# Altium project Twitch_Switch_PCB.PrjPcb (part 1 of 3)
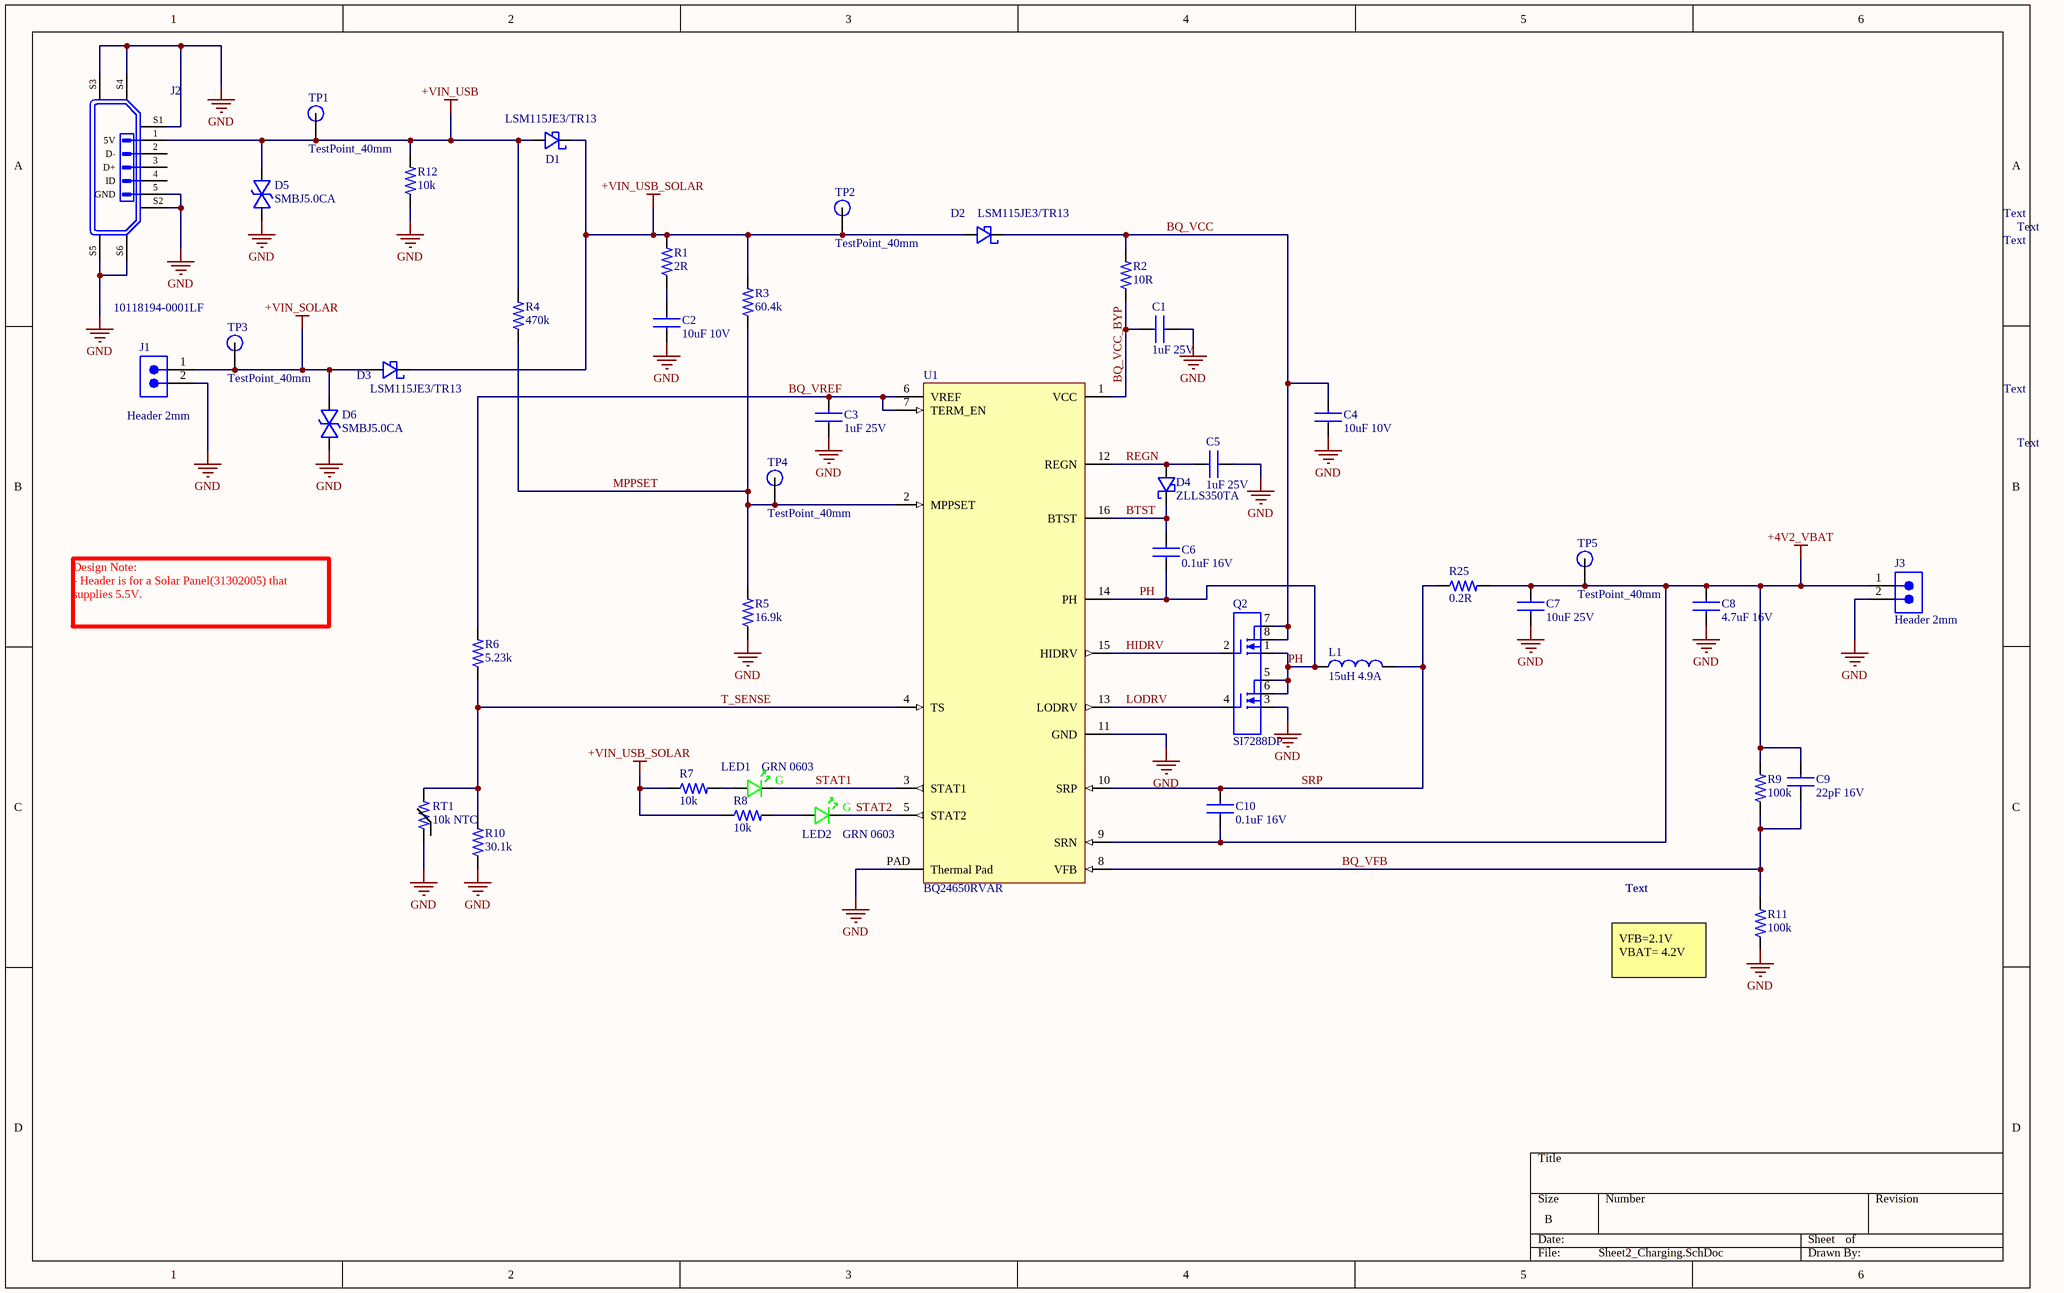
[diagram p0: Sheet2_Charging.SchDoc]
6 sheets, 103 parts. Net scope: global (net labels, ports and power ports of the same name join across sheets).
Board file: Twitch_Switch_PCB.PcbDoc
Sheets:
  Sheet1_Title.SchDoc
  Sheet2_Charging.SchDoc
  Sheet3_Power.SchDoc
  Sheet4_MCU_Sensors.SchDoc
  Sheet5_MCU_PowerDecoupling.SchDoc
  Sheet6_MCU_Antenna_Radio_Interface.SchDoc

## Sheet Sheet1_Title.SchDoc
size A; SheetNumber: 1; SheetTotal: 1

## Sheet Sheet2_Charging.SchDoc
size B; SheetNumber: 2; SheetTotal: 6

### Parts
C1  1uF 25V  [CAP_0805_1_4MM]
C2  10uF 10V  [CAP_0805_1_4MM]
C3  1uF 25V  [CAP_0805_1_4MM]
C4  10uF 10V  [CAP_0805_1_4MM]
C5  1uF 25V  [CAP_0805_1_4MM]
C6  0.1uF 16V  [CAP_0805_1_4MM]
C7  10uF 25V  [CAP_0805_1_4MM]
C8  4.7uF 16V  [CAP_0805_1_4MM]
C9  22pF 16V  [CAP_0805_1_4MM]
C10  0.1uF 16V  [CAP_0805_1_4MM]
D1  LSM115JE3/TR13  [DIODE_4_31X3_62MM]
D2  LSM115JE3/TR13  [DIODE_4_31X3_62MM]
D3  LSM115JE3/TR13  [DIODE_4_31X3_62MM]
D4  ZLLS350TA  [DIODE-SOD_08X16]
D5  SMBJ5.0CA  [DIOM4436X26N]
D6  SMBJ5.0CA  [DIOM4436X26N]
J1  Header 2mm  [2-PIN_MALE_HEADER_2MM]
J2  Manufacturer Part Number: 10118194-0001LF  [micro-USB]  (hidden comment: micro-USB)
J3  Header 2mm  [2-PIN_MALE_HEADER_2MM]
L1  15uH 4.9A  [IND_818X818]
LED1  GRN 0603  [LED_0603_GRN_WL-SMCW]
LED2  GRN 0603  [LED_0603_GRN_WL-SMCW]
Q2  SI7288DP  [FET-SO8_POWERPAK_515X615]
R1  2R  [RES_1206_310X16]
R2  10R  [RES_1206_310X16]
R3  60.4k  [RES_0603_1608X06]
R4  470k  [RES_0603_1608X06]
R5  16.9k  [RES_0603_1608X06]
R6  5.23k  [RES_0603_1608X06]
R7  10k  [RES_0805_2X1_25MM]
R8  10k  [RES_0805_2X1_25MM]
R9  100k  [RES_0603_1608X06]
R10  30.1k  [RES_0603_1608X06]
R11  100k  [RES_0603_1608X06]
R12  10k  [RES_0805_2X1_25MM]
R25  0.2R  [RES_0603_1608X06]
RT1  10k NTC  [NTC-2_THRUHOLE]
TP1  TestPoint_40mm  [TP_40MM]
TP2  TestPoint_40mm  [TP_40MM]
TP3  TestPoint_40mm  [TP_40MM]
TP4  TestPoint_40mm  [TP_40MM]
TP5  TestPoint_40mm  [TP_40MM]
U1  BQ24650RVAR  [16-QFN_3_5x3_5]

### Nets
+4V2_VBAT: C7.1 C8.1 C9.2 C10.2 J3.1 R9.2 R25.2 TP5.1 U1.9(SRN)
+VIN_SOLAR: D3.2(ANODE) D6.1 J1.1 TP3.1
+VIN_USB: D1.2(ANODE) D5.1 J2.1(5V) R4.2 R12.2 TP1.1
+VIN_USB_SOLAR: D1.1(CATHODE) D2.2(ANODE) D3.1(CATHODE) R1.2 R3.2 R7.1 R8.1 TP2.1
GND: C1.2 C2.2 C3.2 C4.2 C5.2 C7.2 C8.2 D5.2 D6.2 J1.2 J2.5(GND) J2.S1(GND) J2.S2(GND) J2.S3(GND) J2.S4(GND) J2.S5(GND) J2.S6(GND) J3.2 Q2.3(S2) R5.1 R10.1 R11.1 R12.1 RT1.1 U1.11(GND) U1.PAD(Thermal_Pad)
BQ_VCC: C4.1 D2.1(CATHODE) Q2.7(D1_1) Q2.8(D1_2) R2.2
BQ_VCC_BYP: C1.1 R2.1 U1.1(VCC)
BQ_VFB: C9.1 R9.1 R11.2 U1.8(VFB)
BQ_VREF: C3.1 R6.2 U1.6(VREF) U1.7(TERM_EN)
BTST: C6.1 D4.1(CATHODE) U1.16(BTST)
HIDRV: Q2.2(G1) U1.15(HIDRV)
LODRV: Q2.4(G2) U1.13(LODRV)
MPPSET: R3.1 R4.1 R5.2 TP4.1 U1.2(MPPSET)
PH: C6.2 L1.1 Q2.1(S1) Q2.5(D2_1) Q2.6(D2_2) U1.14(PH)
REGN: C5.1 D4.2(ANODE) U1.12(REGN)
SRP: C10.1 L1.2 R25.1 U1.10(SRP)
STAT1: LED1.C U1.3(STAT1)
STAT2: LED2.C U1.5(STAT2)
T_SENSE: R6.1 R10.2 RT1.2 U1.4(TS)
NetC2_1: C2.1 R1.1
NetLED1_A: LED1.A R7.2
NetLED2_A: LED2.A R8.2

Not connected (* = marked no-connect by the designer): J2 2(D-) 3(D+) 4(ID)

### Notes on the sheet
- Text
- Design Note:
  - Header is for a Solar Panel(31302005) that supplies 5.5V.
- VFB=2.1V
  VBAT= 4.2V
- (in symbol 150060GS75000) G

### Library data of the parts
C1 C3 C5 = CL21A105KACLNNC: Cap Ceramic 1uF 25V X5R 10% SMD 0805 85C Paper T/R; Manufacturer: Samsung; Supplier 1: Digi-Key; Manufacturer Part Number: CL21A105KACLNNC; RoHS: Yes; Category: Ceramic Capacitors; Stock 1: 356000; Pricing 1: 4000=0.02185, 8000=0.02033 (USD); Mount: Surface Mount; Case/Package: 0805; Case Code (Metric): 2012; Case Code (Imperial): 0805; Min Operating Temperature: -55°C; Max Operating Temperature: 85°C; Capacitance: 1uF; Tolerance: 10%; Dielectric: X5R; Package Quantity: 1; Packaging: Tape and Reel; Voltage Rating: 25V; Series: CL; Construction: Flat; Length: 2mm; Width: 0.049inch; Height: 0.85mm; Depth: 1.25mm; Thickness: 0.037inch; Radiation Hardening: No; Lead Free: Lead Free; RoHS Compliant: Yes; ComponentLink1URL: https://datasheet.ciiva.com/25719/cl21a105kaclnnc-25719413.pdf?src-supplier=Digi-Key; ComponentLink1Description: https://datasheet.ciiva.com/25719/cl21a105kaclnnc-25719413.pdf?src-supplier=Digi-Key; ComponentLink2URL: https://datasheet.ciiva.com/16291/cl21a105kaclnnc-16291978.pdf?src-supplier=Future+Electronics; ComponentLink2Description: https://datasheet.ciiva.com/16291/cl21a105kaclnnc-16291978.pdf?src-supplier=Future+Electronics
C2 C4 = LMK212BJ225MG-T: CAP CER 2.2UF 10V X5R 0805; Manufacturer: Taiyo Yuden; Tolerance: 20%; Supplier 1: Digi-Key; Manufacturer Part Number: LMK212BJ225MG-T; RoHS: Yes; Category: Ceramic Capacitors; Stock 1: 15727; Pricing 1: 1=0.14000, 10=0.10200, 50=0.05780, 100=0.04780, 500=0.03356, 1000=0.02778 (USD); Mount: Surface Mount; Case/Package: 0805; Case Code (Imperial): 0805; Case Code (Metric): 2012; Weight: 0.000194oz; Min Operating Temperature: -55°C; Max Operating Temperature: 85°C; Capacitance: 2.2uF; Packaging: Tape and Reel; Voltage Rating (DC): 10V; Voltage Rating: 10V; Dielectric: X5R; Termination: SMD/SMT; Resistor Type: Ceramic; Voltage: 10V; Series: M; Length: 2mm; Width: 1.25mm; Height: 1.25mm; Thickness: 0.053inch; Depth: 1.25mm; Radiation Hardening: No; Lead Free: Lead Free; Halogen Free: Halogen Free; RoHS Compliant: Yes; ComponentLink1URL: http://www.mouser.com/ds/2/396/mlcc_all_e-541559.pdf?src-supplier=Mouser; ComponentLink1Description: http://www.mouser.com/ds/2/396/mlcc_all_e-541559.pdf?src-supplier=Mouser; ComponentLink2URL: https://www.yuden.co.jp/productdata/catalog/mlcc01_e.pdf?src-supplier=Digi-Key; ComponentLink2Description: https://www.yuden.co.jp/productdata/catalog/mlcc01_e.pdf?src-supplier=Digi-Key; ComponentLink3URL: http://documents.rs-components.com/techlib://itc_doclist_GB.htm?stockno=7582925&src-supplier=RSComponents; ComponentLink3Description: http://documents.rs-components.com/techlib://itc_doclist_GB.htm?stockno=7582925&src-supplier=RSComponents; ComponentLink4URL: http://ds.yuden.co.jp/TYCOMPAS/ut/detail.do?productNo=LMK212BJ225MG-T&fileName=LMK212BJ225MG-T_SS&mode=specSheetDownload&src-supplier=Digi-Key; ComponentLink4Description: http://ds.yuden.co.jp/TYCOMPAS/ut/detail.do?productNo=LMK212BJ225MG-T&fileName=LMK212BJ225MG-T_SS&mode=specSheetDownload&src-supplier=Digi-Key; ComponentLink5URL: http://www.yuden.co.jp/productdata/catalog/en/mlcc_all_e.pdf?src-supplier=Digi-Key; ComponentLink5Description: http://www.yuden.co.jp/productdata/catalog/en/mlcc_all_e.pdf?src-supplier=Digi-Key
C6 C10 = CC0805JRX7R7BB104: CAP CER 0.1UF 16V X7R 0805; Manufacturer: Yageo; Capacitance: 100nF; Tolerance: 5%; Supplier 1: Digi-Key; Manufacturer Part Number: CC0805JRX7R7BB104; RoHS: Yes; Category: Ceramic Capacitors; Stock 1: 2346; Pricing 1: 1=0.12000, 10=0.08400, 50=0.04760, 100=0.03950, 500=0.02768, 1000=0.02291 (USD); Mount: Surface Mount; Case/Package: 0805; Case Code (Imperial): 0805; Case Code (Metric): 2012; Weight: 0.000194oz; Min Operating Temperature: -55°C; Max Operating Temperature: 125°C; Packaging: Tape and Reel; Voltage Rating (DC): 16V; Voltage Rating: 16V; Dielectric: X7R; Termination: SMD/SMT; Resistor Type: Ceramic; Series: CC; Length: 2mm; Width: 0.049inch; Thickness: 0.037inch; Depth: 1.25mm; Radiation Hardening: No; Lead Free: Lead Free; Halogen Free: Halogen Free; RoHS Compliant: Yes; ComponentLink1URL: https://datasheet.ciiva.com/26918/getdatasheetpartid-755584-26918332.pdf?src-supplier=Verical; ComponentLink1Description: https://datasheet.ciiva.com/26918/getdatasheetpartid-755584-26918332.pdf?src-supplier=Verical; ComponentLink2URL: https://datasheet.ciiva.com/17434/upy-gphc-x7r-6-3v-to-50v-8-17434890.pdf?src-supplier=Avnet+Europe; ComponentLink2Description: https://datasheet.ciiva.com/17434/upy-gphc-x7r-6-3v-to-50v-8-17434890.pdf?src-supplier=Avnet+Europe
C7 = GRM21BR61E106KA73K: CAP CER 10UF 25V X5R 0805; Manufacturer: Murata; Tolerance: 10%; Supplier 1: Digi-Key; Manufacturer Part Number: GRM21BR61E106KA73K; RoHS: Yes; Category: Ceramic Capacitors; Stock 1: 101639; Pricing 1: 1=0.23000, 10=0.15700, 50=0.09400, 100=0.07940, 500=0.05434, 1000=0.04807, 2500=0.04598, 5000=0.04180 (USD); Mount: Surface Mount; Case/Package: 0805; Weight: 0.000335oz; Min Operating Temperature: -55°C; Max Operating Temperature: 85°C; Packaging: Tape and Reel; Capacitance: 10uF; Voltage Rating: 25V; Package Quantity: 10000; Dielectric: X5R; Voltage Rating (DC): 25V; Length: 0.079inch; Width: 0.049inch; Thickness: 0.055inch; RoHS Compliant: Yes; ComponentLink1URL: http://www.mouser.com/ds/2/281/c02e-2905.pdf?src-supplier=Mouser; ComponentLink1Description: http://www.mouser.com/ds/2/281/c02e-2905.pdf?src-supplier=Mouser; ComponentLink2URL: http://search.murata.co.jp/Ceramy/image/img/A01X/G101/ENG/GRM21BR61E106KA73-01.pdf?src-supplier=Digi-Key; ComponentLink2Description: http://search.murata.co.jp/Ceramy/image/img/A01X/G101/ENG/GRM21BR61E106KA73-01.pdf?src-supplier=Digi-Key; ComponentLink3URL: https://search.murata.co.jp/Ceramy/image/img/A01X/G101/ENG/GRM21BR61E106KA73-01.pdf?src-supplier=Digi-Key; ComponentLink3Description: https://search.murata.co.jp/Ceramy/image/img/A01X/G101/ENG/GRM21BR61E106KA73-01.pdf?src-supplier=Digi-Key
C8 = CL21A475KOFNNNG: CAP CER 4.7UF 16V X5R 0805; Manufacturer: Samsung; Material: Ceramic; Tolerance: 10%; Supplier 1: Digi-Key; Manufacturer Part Number: CL21A475KOFNNNG; RoHS: Yes; Category: Ceramic Capacitors; Stock 1: 18827; Pricing 1: 1=0.12000, 10=0.08800, 50=0.05000, 100=0.04140, 500=0.02906, 1000=0.02405 (USD); Mount: Surface Mount; Case/Package: 0805; Case Code (Metric): 2012; Case Code (Imperial): 0805; Min Operating Temperature: -55°C; Max Operating Temperature: 85°C; Capacitance: 4.7uF; Package Quantity: 3000; Packaging: Tape and Reel; Voltage Rating: 16V; Dielectric: X5R; Voltage: 16V; Series: CL; Length: 2mm; Width: 0.049inch; Height: 1.25mm; Thickness: 0.053inch; Depth: 1.25mm; Lead Free: Lead Free; RoHS Compliant: Yes; ComponentLink1URL: https://datasheet.ciiva.com/25731/cl21a475kofnnng-25731814.pdf?src-supplier=Digi-Key; ComponentLink1Description: https://datasheet.ciiva.com/25731/cl21a475kofnnng-25731814.pdf?src-supplier=Digi-Key; ComponentLink2URL: https://datasheet.ciiva.com/29199/455276-da-01-en-vs-kondensator-0805-29199361.pdf?src-supplier=Conrad; ComponentLink2Description: https://datasheet.ciiva.com/29199/455276-da-01-en-vs-kondensator-0805-29199361.pdf?src-supplier=Conrad; ComponentLink3URL: https://datasheet.ciiva.com/26310/mlcc-catalogdownload2013-eng-26310158.pdf?src-supplier=Distrelec; ComponentLink3Description: https://datasheet.ciiva.com/26310/mlcc-catalogdownload2013-eng-26310158.pdf?src-supplier=Distrelec; ComponentLink4URL: https://datasheet.ciiva.com/16428/cl05b104kq5nnnc-16428879.pdf?src-supplier=Future+Electronics; ComponentLink4Description: https://datasheet.ciiva.com/16428/cl05b104kq5nnnc-16428879.pdf?src-supplier=Future+Electronics
C9 = VJ0805A220KXJPW1BC: CAP CER 22PF 16V C0G/NP0 0805; Manufacturer: Vishay Vitramon; Dielectric Material: Tantalum; Tolerance: 10%; Dielectric: C0G; Supplier 1: Digi-Key; Manufacturer Part Number: VJ0805A220KXJPW1BC; RoHS: Yes; Category: Ceramic Capacitors; Stock 1: 14990; Pricing 1: 1=0.20000, 10=0.14000, 50=0.07940, 100=0.06580, 500=0.04614, 1000=0.03819, 2500=0.03554, 5000=0.03252 (USD); Mount: Surface Mount; Case/Package: 0805; Case Code (Imperial): 0805; Case Code (Metric): 2012; Min Operating Temperature: -55°C; Max Operating Temperature: 125°C; Capacitance: 22pF; Voltage Rating (DC): 16V; Packaging: Tape and Reel; Package Quantity: 15000; Termination: SMD/SMT; Series: VJ W1BC; Construction: Flat; Length: 2mm; Width: 1.25mm; Height: 1.45mm; Depth: 1.25mm; Lead Free: Lead Free; RoHS Compliant: Yes; ComponentLink1URL: http://www.mouser.com/ds/2/427/vjw1bcbascomseries-223529.pdf?src-supplier=Mouser; ComponentLink1Description: http://www.mouser.com/ds/2/427/vjw1bcbascomseries-223529.pdf?src-supplier=Mouser; ComponentLink2URL: http://www.vishay.com/docs/28548/vjw1bcbascomseries.pdf?src-supplier=Avnet; ComponentLink2Description: http://www.vishay.com/docs/28548/vjw1bcbascomseries.pdf?src-supplier=Avnet; ComponentLink3URL: https://www.vishay.com/docs/28548/vjw1bcbascomseries.pdf?src-supplier=Digi-Key; ComponentLink3Description: https://www.vishay.com/docs/28548/vjw1bcbascomseries.pdf?src-supplier=Digi-Key
D1-D3 = LSM115JE3/TR13: DIODE SCHOTTKY 30V 200MA SOD323; Manufacturer: Microsemi; Forward Voltage: 220mV; Forward Current: 1A; Max Reverse Current: 10mA; Reverse Voltage (DC): 15V; Peak Non-Repetitive Surge Current: 50A; Element Configuration: Single; Max Reverse Leakage Current: 50uA; Power Dissipation: 250mW; Supplier 1: Digi-Key; Manufacturer Part Number: LSM115JE3/TR13; RoHS: Yes; Category: Rectifier Diodes; Stock 1: 39247; Pricing 1: 1=1.08000, 10=0.88700, 100=0.69010, 500=0.58490, 1000=0.47647 (USD); Mount: Surface Mount; Number of Pins: 2; Weight: 0.003668oz; Min Operating Temperature: -55°C; Max Operating Temperature: 100°C; Packaging: Tape and Reel; Package Quantity: 3000; Average Rectified Current: 1A; Max Repetitive Reverse Voltage (Vrrm): 15V; Max Forward Surge Current (Ifsm): 50A; Max Reverse Voltage (DC): 15V; Radiation Hardening: No; Lead Free: Lead Free; ComponentLink1URL: https://datasheet.ciiva.com/917/lsm115j-917432.pdf?src-supplier=Digi-Key; ComponentLink1Description: https://datasheet.ciiva.com/917/lsm115j-917432.pdf?src-supplier=Digi-Key; Supplier 2: Digi-Key; Stock 2: 32; Pricing 2: 1=0.63000, 10=0.54300, 100=0.37560, 500=0.31386, 1000=0.26712 (USD); Max Surge Current: 1A; Voltage: 30V; Series: -; RoHS Compliant: No; ComponentLink2URL: https://datasheet.ciiva.com/4715/cmdsh2-3-39086-4715895.pdf?src-supplier=Mouser; ComponentLink2Description: https://datasheet.ciiva.com/4715/cmdsh2-3-39086-4715895.pdf?src-supplier=Mouser; ComponentLink3URL: https://datasheet.ciiva.com/16396/cmdsh2-3-16396583.pdf?src-supplier=Future+Electronics; ComponentLink3Description: https://datasheet.ciiva.com/16396/cmdsh2-3-16396583.pdf?src-supplier=Future+Electronics
D4 = ZLLS350TA: Diode Schottky 40V 0.65A 2Pin SOD523; Manufacturer: Diodes Zetex; Forward Current: 650mA; Peak Non-Repetitive Surge Current: 6A; Element Configuration: Single; Forward Voltage: 1V; Max Power Dissipation: 357mW; Max Reverse Current: 4uA; Reverse Recovery Time: 1ns; Average Rectified Current: 380mA; Polarity: Standard; Capacitance: 3.5pF; Diode Type: RECTIFIER; Supplier 1: Digi-Key; Manufacturer Part Number: ZLLS350TA; RoHS: Yes; Category: Schottky Diodes; Stock 1: 114407; Pricing 1: 1=0.44000, 10=0.37700, 100=0.26180, 500=0.20442, 1000=0.16616 (USD); Mount: Surface Mount; Number of Pins: 2; Weight: 3.5E-05oz; Contact Plating: Tin,Matte; Min Operating Temperature: -55°C; Max Operating Temperature: 150°C; Max Repetitive Reverse Voltage (Vrrm): 40V; Packaging: Tape and Reel; Package Quantity: 3000; Max Forward Surge Current (Ifsm): 6A; Power Dissipation: 357mW; Termination: SMD/SMT; Voltage Rating (DC): 40V; Power Rating: 357mW; Current Rating: 380mA; Output Current: 380mA; Max Reverse Voltage (DC): 40V; Series: -; Length: 1.3mm; Width: 0.9mm; Height: 0.8mm; Radiation Hardening: No; Lead Free: Lead Free; RoHS Compliant: Yes; ComponentLink1URL: https://datasheet.ciiva.com/4715/zlls350-4715700.pdf?src-supplier=Avnet; ComponentLink1Description: https://datasheet.ciiva.com/4715/zlls350-4715700.pdf?src-supplier=Avnet; ComponentLink2URL: https://datasheet.ciiva.com/4715/zlls350-4715700.pdf?src-supplier=Mouser; ComponentLink2Description: https://datasheet.ciiva.com/4715/zlls350-4715700.pdf?src-supplier=Mouser; ComponentLink3URL: https://datasheet.ciiva.com/914/zlls350-914216.pdf?src-supplier=Digi-Key; ComponentLink3Description: https://datasheet.ciiva.com/914/zlls350-914216.pdf?src-supplier=Digi-Key; ComponentLink4URL: https://datasheet.ciiva.com/914/zlls350-914217.pdf?src-supplier=Digi-Key; ComponentLink4Description: https://datasheet.ciiva.com/914/zlls350-914217.pdf?src-supplier=Digi-Key; ComponentLink5URL: https://datasheet.ciiva.com/914/zlls350-914218.pdf?src-supplier=Digi-Key; ComponentLink5Description: https://datasheet.ciiva.com/914/zlls350-914218.pdf?src-supplier=Digi-Key
D5 D6 = SMBJ5.0CA: BOURNS - SMBJ5.0CA - TVS Diode, Transil SMBJ Series, Bidirectional, 5 V, 9.2 V, DO-214AA (SMB), 2 Pins; Reverse Standoff Voltage: 5V; Clamping Voltage: 9.2V; Peak Pulse Current: 65.2A; Peak Pulse Power: 600W; Test Current: 10mA; Min Breakdown Voltage: 6.4V; Breakdown Voltage: 7.25V; Number of Elements: 1; Leakage Current: 1.6mA; Max Surge Current: 100A; Element Configuration: Single; Operating Supply Voltage: 3.5V; Power Line Protection: No; Diode Type: ZENER; Supplier 1: Digi-Key; Manufacturer: Bourns; Manufacturer Part Number: SMBJ5.0CA; RoHS: Yes; Category: TVS Diodes; Stock 1: 1299; Pricing 1: 1=0.49000, 10=0.36900, 100=0.22960, 500=0.15710, 1000=0.12084 (USD); Mount: Surface Mount; Case/Package: DO-214AA; Number of Pins: 2; Min Operating Temperature: -55°C; Max Operating Temperature: 150°C; Packaging: Tape and Reel; Polarity: Bidirectional; Direction: Bidirectional; Package Quantity: 1; Reverse Breakdown Voltage: 6.4V; Max Reverse Leakage Current: 1.6mA; Number of Channels: 1; Termination: SMD/SMT; Max Power Dissipation: 600W; Max Breakdown Voltage: 7.25V; Number of Bidirectional Channels: 1; Series: SMBJ; Resistor Type: Zener; Radiation Hardening: No; RoHS Compliant: Yes; REACH SVHC: No SVHC; ComponentLink1URL: https://datasheet.ciiva.com/334/smbj-334706.pdf?src-supplier=Digi-Key; ComponentLink1Description: https://datasheet.ciiva.com/334/smbj-334706.pdf?src-supplier=Digi-Key; ComponentLink2URL: https://datasheet.ciiva.com/334/smbj-334707.pdf?src-supplier=Digi-Key; ComponentLink2Description: https://datasheet.ciiva.com/334/smbj-334707.pdf?src-supplier=Digi-Key; ComponentLink3URL: https://datasheet.ciiva.com/334/smbj-334708.pdf?src-supplier=Digi-Key; ComponentLink3Description: https://datasheet.ciiva.com/334/smbj-334708.pdf?src-supplier=Digi-Key; ComponentLink4URL: https://datasheet.ciiva.com/3022/smbj-3022578.pdf?src-supplier=Avnet; ComponentLink4Description: https://datasheet.ciiva.com/3022/smbj-3022578.pdf?src-supplier=Avnet; ComponentLink5URL: https://datasheet.ciiva.com/8031/1677318-8031161.pdf?src-supplier=Element14; ComponentLink5Description: https://datasheet.ciiva.com/8031/1677318-8031161.pdf?src-supplier=Element14; ComponentLink6URL: https://datasheet.ciiva.com/28410/1677318-28410120.pdf?src-supplier=Element14; ComponentLink6Description: https://datasheet.ciiva.com/28410/1677318-28410120.pdf?src-supplier=Element14; ComponentLink7URL: https://datasheet.ciiva.com/30104/smbj-30104446.pdf?src-supplier=Onlinecomponents.com; ComponentLink7Description: https://datasheet.ciiva.com/30104/smbj-30104446.pdf?src-supplier=Onlinecomponents.com
J1 J3 = B2B-PH-K-S(LF)(SN): Connector Header, PH Series, 2 Position, 2.00mm, Through Hole, Press-Fit, Solder, Natural; Manufacturer: JST; Supplier 1: Digi-Key; Manufacturer Part Number: B2B-PH-K-S(LF)(SN); RoHS: Yes; Category: Connectors; Stock 1: 171845; Pricing 1: 1=0.17000, 10=0.16200, 25=0.12080, 50=0.10360, 250=0.08632, 750=0.07771, 1000=0.07252, 12000=0.05526, 24000=0.05008 (USD); Weight: 0.0625lb; Length: 0.2inch; Width: 0.24inch; Height: 0.35inch; ComponentLink1URL: http://www.farnell.com/datasheets/2057211.pdf?src-supplier=Farnell; ComponentLink1Description: http://www.farnell.com/datasheets/2057211.pdf?src-supplier=Farnell; ComponentLink2URL: http://www.farnell.com/datasheets/2057211.pdf?src-supplier=Element14; ComponentLink2Description: http://www.farnell.com/datasheets/2057211.pdf?src-supplier=Element14; ComponentLink3URL: http://www.farnell.com/datasheets/2057211.pdf?src-supplier=Newark; ComponentLink3Description: http://www.farnell.com/datasheets/2057211.pdf?src-supplier=Newark
J2 = micro-USB: 10118194-0001LF micro-USB paste-in-pad; Manufacturer: FCI; Connector Type: USB - micro B; Number of Contacts: 5; Gender: Receptacle; Specifications: USB 2.0; Current Rating: 1.8 A; Mounting Angle: Right; Insulation Resistance: 1000 MOhms; .Creator: Kailey Shara; .SCHchecked: KS; Supplier 1: Digi-Key; RoHS: RoHS Compliant; Category: Connectors, Interconnects; Stock 1: 27978; Pricing 1: 1=0.46, 10=0.433, 25=0.3712, 50=0.3156, 100=0.3032, 250=0.27224, 500=0.25988 (USD); Packaging: Cut Tape (CT); Mounting Type: Surface Mount, Right Angle, Horizontal; Features: Shielded, Solder Retention; Ingress Protection: -; ComponentLink1URL: http://portal.fciconnect.com/Comergent//fci/drawing/10118194.pdf; ComponentLink1Description: http://portal.fciconnect.com/Comergent//fci/drawing/10118194.pdf; Color: Black; Contact Plating: Gold; Operating Temperature Range: - 55 C to + 85 C; Product: Micro USB Type B Connectors; Termination Style: SMD; Brand: FCI; Contact Material: Copper Alloy; Flammability Rating: UL 94 V-0; Standard: USB 2.0; Standard Pack Qty: 1200; Minimum Order Quantity: 1; Reeling: True; Supplier Part Number 1: 609-4618-1-ND; .PCBchecked: KS
L1 = IHLP3232DZER150M11: Inductor High Current Shielded Wirewound 15uH 20% 100KHz 4.9A 65.3mOhm DCR 3232 T/R; Manufacturer: Vishay Dale; Core Material: Ferrite; Saturation Current: 3.7A; Self Resonant Frequency: 10.3MHz; DC Resistance (DCR): 65.3mR; Supplier 1: Digi-Key; Manufacturer Part Number: IHLP3232DZER150M11; RoHS: Yes; Category: Fixed Inductors; Stock 1: 5273; Pricing 1: 1=1.37000, 10=1.26800, 25=1.17040, 50=0.97520, 100=0.91670, 250=0.81916 (USD); Mount: Surface Mount; Case/Package: 3232; Number of Pins: 2; Contact Plating: Tin; Min Operating Temperature: -55°C; Max Operating Temperature: 125°C; Inductance Tolerance: 20%; Packaging: Tape and Reel; Package Quantity: 500; Current Rating: 4.9A; Tolerance: 20%; Shielding: Shielded; Inductance: 15uH; Test Frequency: 100kHz; Max DC Current: 3.7A; Termination: SMD/SMT; RMS Current (Irms): 4.9A; Series: IHLP-3232DZ-11; Length: 8.89mm; Width: 0.322inch; Height: 4mm; Height - Seated (Max): 0.157inch; Depth: 8.26mm; Radiation Hardening: No; REACH SVHC: Unknown; Military Standard: Not; Lead Free: Lead Free; RoHS Compliant: Yes; ComponentLink1URL: https://datasheet.ciiva.com/6692/ihlp-3232dz-11-6692869.pdf?src-supplier=Digi-Key; ComponentLink1Description: https://datasheet.ciiva.com/6692/ihlp-3232dz-11-6692869.pdf?src-supplier=Digi-Key; ComponentLink2URL: https://datasheet.ciiva.com/6692/ihlp-3232dz-11-6692871.pdf?src-supplier=Digi-Key; ComponentLink2Description: https://datasheet.ciiva.com/6692/ihlp-3232dz-11-6692871.pdf?src-supplier=Digi-Key; ComponentLink3URL: https://datasheet.ciiva.com/6692/ihlp-3232dz-11-6692872.pdf?src-supplier=Digi-Key; ComponentLink3Description: https://datasheet.ciiva.com/6692/ihlp-3232dz-11-6692872.pdf?src-supplier=Digi-Key; ComponentLink4URL: https://datasheet.ciiva.com/8494/ihlp3232dz11-8494905.pdf?src-supplier=Avnet; ComponentLink4Description: https://datasheet.ciiva.com/8494/ihlp3232dz11-8494905.pdf?src-supplier=Avnet
LED1 LED2 = 150060GS75000: LED, 0603, GREEN, 430MCD, 520NM; Manufacturer: Wurth Electronics; Dynamic Catalog: 0603 Rectangle with Flat Top Chip LEDs; 3D Model: SMCW_0603.igs / SMCW_0603.stp / SMCW_0603.wrl; Wavelength - Peak: 515nm; Voltage - Forward (Vf) (Typ): 3.2V; Current - Test: 20mA; Viewing Angle: 140°; Lens Type: Clear; Lens Style/Size: Rectangle with Flat Top, 1.1mm x 0.7mm; Other Names: 732-4971-2; Supplier 1: Digi-Key; Manufacturer Part Number: 150060GS75000; Stock 1: 34964; Pricing 1: 1=0.14, 50=0.129, 100=0.11, 500=0.095 (USD); Standard Package: 4,000; Category: Optoelectronics; Family: LED Indication - Discrete; Series: WL-SMCW; Packaging: Tape & Reel (TR); Color: Green; Wavelength - Dominant: 520nm; Millicandela Rating: 430mcd; Package / Case: 0603 (1608 Metric); Size / Dimension: 1.60mm L x 0.80mm W; Height: 0.70mm; Mounting Type: Surface Mount; Online Catalog: 0603 Rectangle with Flat Top Chip LEDs; ComponentLink1URL: https://katalog.we-online.de/led/datasheet/150060GS75000.pdf?src-supplier=Digi-Key; ComponentLink1Description: https://katalog.we-online.de/led/datasheet/150060GS75000.pdf?src-supplier=Digi-Key; ComponentLink2URL: http://www.produktinfo.conrad.com/datenblaetter/750000-774999/759427-da-01-en-CHIPLED_0603_W_KL_GRUEN_150060GS75000.pdf?src-supplier=Conrad; ComponentLink2Description: http://www.produktinfo.conrad.com/datenblaetter/750000-774999/759427-da-01-en-CHIPLED_0603_W_KL_GRUEN_150060GS75000.pdf?src-supplier=Conrad; Supplier Part Number 1: 732-4971-1-ND
Q2 = SI7288DP-T1-GE3: VISHAY - SI7288DP-T1-GE3 - MOSFET, DUAL N-CH, 40V, 20A, POWERPAK SO; Manufacturer: Vishay Siliconix; Rise Time: 14ns; Gate to Source Voltage (Vgs): 20V; Turn-On Delay Time: 12ns; Turn-Off Delay Time: 16ns; Fall Time: 10ns; Nominal Vgs: 1.2V; Rds On Max: 19mR; Input Capacitance: 565pF; Max Power Dissipation: 15.6W; Drain to Source Resistance: 15.6mR; Number of Elements: 2; Power Dissipation: 3.6W; Threshold Voltage: 2.8V; FET Type: 2 N-Channel; Supplier 1: Digi-Key; Manufacturer Part Number: SI7288DP-T1-GE3; RoHS: Yes; Category: MOSFETs; Stock 1: 23843; Pricing 1: 1=1.60000, 10=1.30700, 25=1.28240, 100=1.01640, 500=0.86152, 1000=0.70180 (USD); Mount: Surface Mount; Number of Pins: 8; Contact Plating: Tin,Matte; Min Operating Temperature: -55°C; Max Operating Temperature: 150°C; Continuous Drain Current (ID): 20A; Packaging: Tape and Reel; Package Quantity: 1; Drain to Source Voltage (Vdss): 40V; Drain to Source Breakdown Voltage: 40V; Element Configuration: Dual; Number of Channels: 2; On-State Resistance: 19mR; Radiation Hardening: No; REACH SVHC: Unknown; Lead Free: Lead Free; ComponentLink1URL: https://datasheet.ciiva.com/1253/si7288dp-1253714.pdf?src-supplier=Newark; ComponentLink1Description: https://datasheet.ciiva.com/1253/si7288dp-1253714.pdf?src-supplier=Newark; ComponentLink2URL: https://datasheet.ciiva.com/4442/si7288dp-244449-4442467.pdf?src-supplier=Mouser; ComponentLink2Description: https://datasheet.ciiva.com/4442/si7288dp-244449-4442467.pdf?src-supplier=Mouser; ComponentLink3URL: https://datasheet.ciiva.com/928/si7288dp-928419.pdf?src-supplier=Digi-Key; ComponentLink3Description: https://datasheet.ciiva.com/928/si7288dp-928419.pdf?src-supplier=Digi-Key; ComponentLink4URL: https://datasheet.ciiva.com/928/si7288dp-928420.pdf?src-supplier=Digi-Key; ComponentLink4Description: https://datasheet.ciiva.com/928/si7288dp-928420.pdf?src-supplier=Digi-Key; ComponentLink5URL: https://datasheet.ciiva.com/928/si7288dp-928421.pdf?src-supplier=Digi-Key; ComponentLink5Description: https://datasheet.ciiva.com/928/si7288dp-928421.pdf?src-supplier=Digi-Key; ComponentLink6URL: https://datasheet.ciiva.com/11161/si7288dp-11161495.pdf?src-supplier=Avnet; ComponentLink6Description: https://datasheet.ciiva.com/11161/si7288dp-11161495.pdf?src-supplier=Avnet; ComponentLink7URL: https://datasheet.ciiva.com/26135/si7288dp-26135833.pdf?src-supplier=Avnet+Europe; ComponentLink7Description: https://datasheet.ciiva.com/26135/si7288dp-26135833.pdf?src-supplier=Avnet+Europe; ComponentLink8URL: https://datasheet.ciiva.com/16287/si7288dp-16287085.pdf?src-supplier=Future+Electronics; ComponentLink8Description: https://datasheet.ciiva.com/16287/si7288dp-16287085.pdf?src-supplier=Future+Electronics
R1 = CRM1206-JW-2R2ELF: BOURNS - CRM1206-JW-2R2ELF - SMD Current Sense Resistor, 2.2 ohm, CRM Series, 1206 [3216 Metric], 500 mW, ± 5%, Thick Film; Resistance: 2.2R; Temperature Coefficient: 200ppm/°C; Power Rating: 500mW; Voltage Rating: 200V; Supplier 1: Digi-Key; Manufacturer: Bourns; Manufacturer Part Number: CRM1206-JW-2R2ELF; RoHS: Yes; Category: Chip SMD Resistors; Stock 1: 20424; Pricing 1: 1=0.14000, 10=0.12200, 25=0.08480, 50=0.06580, 100=0.04700, 250=0.03664, 500=0.02914, 1000=0.02068 (USD); Case/Package: 1206; Number of Pins: 2; Case Code (Metric): 3216; Case Code (Imperial): 1206; Min Operating Temperature: -55°C; Max Operating Temperature: 155°C; Tolerance: 5%; Resistor Type: Thick Film; Packaging: Cut Tape; Package Quantity: 5000; Number of Terminations: 2; Max Power Dissipation: 500mW; Voltage Rating (DC): 200V; Series: CRM1206; Construction: Rectangular; Resistance Tolerance: 5%; Length: 3.1mm; Width: 0.063inch; Height: 0.026inch; Depth: 1.6mm; REACH SVHC: No SVHC; Military Standard: Not; RoHS Compliant: Yes; ComponentLink1URL: https://datasheet.ciiva.com/9123/crm0805-1206-2010-9123253.pdf?src-supplier=Avnet; ComponentLink1Description: https://datasheet.ciiva.com/9123/crm0805-1206-2010-9123253.pdf?src-supplier=Avnet; ComponentLink2URL: https://datasheet.ciiva.com/7985/1859481-7985944.pdf?src-supplier=Element14; ComponentLink2Description: https://datasheet.ciiva.com/7985/1859481-7985944.pdf?src-supplier=Element14; ComponentLink3URL: https://datasheet.ciiva.com/6562/crm0805-1206-2010-6562779.pdf?src-supplier=Digi-Key; ComponentLink3Description: https://datasheet.ciiva.com/6562/crm0805-1206-2010-6562779.pdf?src-supplier=Digi-Key; ComponentLink4URL: https://datasheet.ciiva.com/6562/crm0805-1206-2010-6562780.pdf?src-supplier=Digi-Key; ComponentLink4Description: https://datasheet.ciiva.com/6562/crm0805-1206-2010-6562780.pdf?src-supplier=Digi-Key; ComponentLink5URL: https://datasheet.ciiva.com/6562/crm0805-1206-2010-6562782.pdf?src-supplier=Digi-Key; ComponentLink5Description: https://datasheet.ciiva.com/6562/crm0805-1206-2010-6562782.pdf?src-supplier=Digi-Key; ComponentLink6URL: https://datasheet.ciiva.com/16929/crm0805-1206-2010-16929262.pdf?src-supplier=Avnet+Europe; ComponentLink6Description: https://datasheet.ciiva.com/16929/crm0805-1206-2010-16929262.pdf?src-supplier=Avnet+Europe
R2 = ERJ8ENF10R0V: PANASONIC - ERJ8ENF10R0V - SMD Chip Resistor, 1206 [3216 Metric], 10 ohm, ERJ8EN Series, 200 V, Thick Film, 250 mW; Tolerance: 1%; Temperature Coefficient: 100ppm/°C; Power Rating: 250mW; Voltage Rating: 200V; Supplier 1: Digi-Key; Manufacturer: Panasonic; Manufacturer Part Number: ERJ8ENF10R0V; RoHS: Yes; Category: Chip SMD Resistors; Stock 1: 395438; Pricing 1: 1=0.10000, 10=0.08900, 100=0.03410, 1000=0.01500, 2500=0.01296 (USD); Mount: Surface Mount; Case/Package: 1206; Number of Pins: 2; Contact Plating: Tin; Case Code (Metric): 3216; Case Code (Imperial): 1206; Size Code: 1206; Min Operating Temperature: -55°C; Max Operating Temperature: 155°C; Resistance: 10R; Resistor Type: Thick Film; Packaging: Tape and Reel; Package Quantity: 5000; Number of Terminations: 2; Termination: SMD/SMT; Max Power Dissipation: 250mW; Voltage Rating (DC): 200V; Features: Automotive AEC-Q200; Series: ERJ; Resistance Tolerance: 1%; Construction: Rectangular; Length: 3.2mm; Width: 1.6mm; Height: 0.6mm; Depth: 1.6mm; Radiation Hardening: No; REACH SVHC: No SVHC; Military Standard: Not; Lead Free: Lead Free; RoHS Compliant: Yes; ComponentLink1URL: https://datasheet.ciiva.com/7802/426256-7802460.pdf?src-supplier=Element14; ComponentLink1Description: https://datasheet.ciiva.com/7802/426256-7802460.pdf?src-supplier=Element14; ComponentLink2URL: https://datasheet.ciiva.com/16758/70260748-16758703.pdf?src-supplier=Allied+Electronics; ComponentLink2Description: https://datasheet.ciiva.com/16758/70260748-16758703.pdf?src-supplier=Allied+Electronics; ComponentLink3URL: https://datasheet.ciiva.com/24069/aoa0000ce2-24069071.pdf?src-supplier=Mouser; ComponentLink3Description: https://datasheet.ciiva.com/24069/aoa0000ce2-24069071.pdf?src-supplier=Mouser; ComponentLink4URL: https://datasheet.ciiva.com/6082/426256-6082197.pdf?src-supplier=Farnell; ComponentLink4Description: https://datasheet.ciiva.com/6082/426256-6082197.pdf?src-supplier=Farnell; ComponentLink5URL: https://datasheet.ciiva.com/16724/70260748-16724651.pdf?src-supplier=Allied+Electronics; ComponentLink5Description: https://datasheet.ciiva.com/16724/70260748-16724651.pdf?src-supplier=Allied+Electronics; ComponentLink6URL: https://datasheet.ciiva.com/46372/1678782-46372959.pdf?src-supplier=Element14; ComponentLink6Description: https://datasheet.ciiva.com/46372/1678782-46372959.pdf?src-supplier=Element14
R3 = CRCW060360K4FKEA: VISHAY - CRCW060360K4FKEA - SMD Chip Resistor, 0603 [1608 Metric], 60.4 kohm, CRCW e3 Series, 75 V, Thick Film, 100 mW; Resistance: 60.4kR; Tolerance: 1%; Temperature Coefficient: 100ppm/°C; Max Power Dissipation: 100mW; Voltage Rating: 75V; Supplier 1: Digi-Key; Manufacturer: Vishay; Manufacturer Part Number: CRCW060360K4FKEA; RoHS: Yes; Category: Chip SMD Resistors; Stock 1: 18673; Pricing 1: 1=0.10000, 10=0.03400, 100=0.01390, 1000=0.00624, 2500=0.00542 (USD); Case/Package: 0603; Contact Plating: Tin; Weight: 7.1E-05oz; Case Code (Metric): 1608; Case Code (Imperial): 0603; Size Code: 0603; Min Operating Temperature: -55°C; Max Operating Temperature: 155°C; Resistor Type: Thick Film; Packaging: Tape and Reel; Package Quantity: 10; Number of Terminations: 2; Features: Automotive AEC-Q200; Series: CRCW; Power Rating: 100mW; Termination: SMD/SMT; Voltage Rating (DC): 75V; Resistance Tolerance: 1%; Technology: THICK FILM; Construction: Rectangular; Length: 1.55mm; Width: 0.033inch; Height: 0.45mm; Depth: 0.85mm; Radiation Hardening: No; Lead Free: Lead Free; RoHS Compliant: Yes; REACH SVHC: Unknown; Military Standard: Not; ComponentLink1URL: https://datasheet.ciiva.com/11809/0900766b80d98afc-11809685.pdf?src-supplier=RSComponents; ComponentLink1Description: https://datasheet.ciiva.com/11809/0900766b80d98afc-11809685.pdf?src-supplier=RSComponents; ComponentLink2URL: https://datasheet.ciiva.com/16391/dcrcwe3-16391304.pdf?src-supplier=Future+Electronics; ComponentLink2Description: https://datasheet.ciiva.com/16391/dcrcwe3-16391304.pdf?src-supplier=Future+Electronics; ComponentLink3URL: https://datasheet.ciiva.com/16893/dcrcwe3-16893592.pdf?src-supplier=Avnet+Europe; ComponentLink3Description: https://datasheet.ciiva.com/16893/dcrcwe3-16893592.pdf?src-supplier=Avnet+Europe; ComponentLink4URL: https://datasheet.ciiva.com/3257/dcrcwe3-3257786.pdf?src-supplier=Avnet; ComponentLink4Description: https://datasheet.ciiva.com/3257/dcrcwe3-3257786.pdf?src-supplier=Avnet; ComponentLink5URL: https://datasheet.ciiva.com/2494/dcrcwe3-2494471.pdf?src-supplier=Digi-Key; ComponentLink5Description: https://datasheet.ciiva.com/2494/dcrcwe3-2494471.pdf?src-supplier=Digi-Key; ComponentLink6URL: https://datasheet.ciiva.com/16760/70201119-16760503.pdf?src-supplier=Allied+Electronics; ComponentLink6Description: https://datasheet.ciiva.com/16760/70201119-16760503.pdf?src-supplier=Allied+Electronics; ComponentLink7URL: https://datasheet.ciiva.com/2494/dcrcwe3-2494472.pdf?src-supplier=Digi-Key; ComponentLink7Description: https://datasheet.ciiva.com/2494/dcrcwe3-2494472.pdf?src-supplier=Digi-Key; ComponentLink8URL: https://datasheet.ciiva.com/22676/1847332-22676330.pdf?src-supplier=Element14; ComponentLink8Description: https://datasheet.ciiva.com/22676/1847332-22676330.pdf?src-supplier=Element14; ComponentLink9URL: https://datasheet.ciiva.com/7816/1697337-7816053.pdf?src-supplier=Element14; ComponentLink9Description: https://datasheet.ciiva.com/7816/1697337-7816053.pdf?src-supplier=Element14; ComponentLink10URL: https://datasheet.ciiva.com/2494/dcrcwe3-2494473.pdf?src-supplier=Digi-Key; ComponentLink10Description: https://datasheet.ciiva.com/2494/dcrcwe3-2494473.pdf?src-supplier=Digi-Key; ComponentLink11URL: https://datasheet.ciiva.com/5545/dcrcwe3-109170-5545721.pdf?src-supplier=Mouser; ComponentLink11Description: https://datasheet.ciiva.com/5545/dcrcwe3-109170-5545721.pdf?src-supplier=Mouser; ComponentLink12URL: https://datasheet.ciiva.com/3257/dcrcwe3-3257787.pdf?src-supplier=Avnet; ComponentLink12Description: https://datasheet.ciiva.com/3257/dcrcwe3-3257787.pdf?src-supplier=Avnet
R4 = CRCW0603470KFKEA: VISHAY - CRCW0603470KFKEA - SMD Chip Resistor, 0603 [1608 Metric], 470 kohm, CRCW e3 Series, 75 V, Thick Film, 100 mW; Resistance: 470kR; Tolerance: 1%; Power Rating: 100mW; Temperature Coefficient: 100ppm/°C; Voltage Rating: 75V; Supplier 1: Digi-Key; Manufacturer: Vishay; Manufacturer Part Number: CRCW0603470KFKEA; RoHS: Yes; Category: Chip SMD Resistors; Stock 1: 4420; Pricing 1: 1=0.10000, 10=0.03400, 100=0.01390, 1000=0.00624, 2500=0.00542 (USD); Mount: Surface Mount; Case/Package: 0603; Number of Pins: 2; Contact Plating: Tin; Weight: 7.1E-05oz; Case Code (Metric): 1608; Case Code (Imperial): 0603; Size Code: 0603; Min Operating Temperature: -55°C; Max Operating Temperature: 155°C; Resistor Type: Thick Film; Termination: SMD/SMT; Packaging: Tape and Reel; Package Quantity: 10; Number of Terminations: 2; Max Power Dissipation: 100mW; Voltage Rating (DC): 75V; Features: Automotive AEC-Q200; Series: CRCW; Construction: Rectangular; Resistance Tolerance: 1%; Technology: THICK FILM; Length: 1.55mm; Width: 0.033inch; Height: 0.45mm; Depth: 0.85mm; Radiation Hardening: No; Lead Free: Lead Free; RoHS Compliant: Yes; REACH SVHC: Unknown; Military Standard: Not; ComponentLink1URL: https://datasheet.ciiva.com/11809/0900766b80d98afc-11809059.pdf?src-supplier=RSComponents; ComponentLink1Description: https://datasheet.ciiva.com/11809/0900766b80d98afc-11809059.pdf?src-supplier=RSComponents; ComponentLink2URL: https://datasheet.ciiva.com/2466/dcrcwe3-2466326.pdf?src-supplier=Digi-Key; ComponentLink2Description: https://datasheet.ciiva.com/2466/dcrcwe3-2466326.pdf?src-supplier=Digi-Key; ComponentLink3URL: https://datasheet.ciiva.com/2466/dcrcwe3-2466327.pdf?src-supplier=Digi-Key; ComponentLink3Description: https://datasheet.ciiva.com/2466/dcrcwe3-2466327.pdf?src-supplier=Digi-Key; ComponentLink4URL: https://datasheet.ciiva.com/2466/dcrcwe3-2466328.pdf?src-supplier=Digi-Key; ComponentLink4Description: https://datasheet.ciiva.com/2466/dcrcwe3-2466328.pdf?src-supplier=Digi-Key; ComponentLink5URL: https://datasheet.ciiva.com/7673/1720486-7673467.pdf?src-supplier=Element14; ComponentLink5Description: https://datasheet.ciiva.com/7673/1720486-7673467.pdf?src-supplier=Element14; ComponentLink6URL: https://datasheet.ciiva.com/16430/dcrcwe3-16430126.pdf?src-supplier=Future+Electronics; ComponentLink6Description: https://datasheet.ciiva.com/16430/dcrcwe3-16430126.pdf?src-supplier=Future+Electronics; ComponentLink7URL: https://datasheet.ciiva.com/5551/dcrcwe3-109170-5551097.pdf?src-supplier=Mouser; ComponentLink7Description: https://datasheet.ciiva.com/5551/dcrcwe3-109170-5551097.pdf?src-supplier=Mouser; ComponentLink8URL: https://datasheet.ciiva.com/16760/70201119-16760810.pdf?src-supplier=Allied+Electronics; ComponentLink8Description: https://datasheet.ciiva.com/16760/70201119-16760810.pdf?src-supplier=Allied+Electronics; ComponentLink9URL: https://datasheet.ciiva.com/7673/1697337-7673309.pdf?src-supplier=Element14; ComponentLink9Description: https://datasheet.ciiva.com/7673/1697337-7673309.pdf?src-supplier=Element14; ComponentLink10URL: https://datasheet.ciiva.com/26317/fld-crcw-e3-data-en-26317181.pdf?src-supplier=Distrelec; ComponentLink10Description: https://datasheet.ciiva.com/26317/fld-crcw-e3-data-en-26317181.pdf?src-supplier=Distrelec
R5 = CRCW060316K9FKEAHP: RES SMD 16.9K OHM 1% 1/4W 0603; Manufacturer: Vishay Dale; Resistance: 16.9kR; Max Power Dissipation: 250mW; Temperature Coefficient: 100ppm/°C; Supplier 1: Digi-Key; Manufacturer Part Number: CRCW060316K9FKEAHP; RoHS: Yes; Category: Chip SMD Resistors; Stock 1: 4990; Pricing 1: 1=0.17000, 10=0.14200, 100=0.05530, 1000=0.02317, 2500=0.02124 (USD); Case/Package: 0603; Package Quantity: 5000; Tolerance: 1%; Packaging: Tape and Reel; Resistor Type: Thick Film; Number of Terminations: 2; Features: Automotive AEC-Q200; Series: CRCW-HP; Length: 0.063inch; Width: 0.033inch; Height: 0.022inch; Lead Free: Lead Free; RoHS Compliant: Yes; ComponentLink1URL: https://datasheet.ciiva.com/2576/crcwhpe3-2576879.pdf?src-supplier=Digi-Key; ComponentLink1Description: https://datasheet.ciiva.com/2576/crcwhpe3-2576879.pdf?src-supplier=Digi-Key
R6 = RMCF0603FT5K23: RES SMD 5.23K OHM 1% 1/10W 0603; Manufacturer: Stackpole Electronics; Resistance: 5.23kR; Max Power Dissipation: 100mW; Temperature Coefficient: 100ppm/°C; Supplier 1: Digi-Key; Manufacturer Part Number: RMCF0603FT5K23; RoHS: Yes; Category: Chip SMD Resistors; Stock 1: 29980; Pricing 1: 1=0.10000, 10=0.01600, 100=0.00650, 1000=0.00292, 2500=0.00253 (USD); Mount: Surface Mount; Case/Package: 0603; Case Code (Metric): 1608; Case Code (Imperial): 0603; Contact Plating: Tin,Matte; Min Operating Temperature: -55°C; Max Operating Temperature: 155°C; Tolerance: 1%; Features: Automotive AEC-Q200; Packaging: Tape and Reel; Resistor Type: Thick Film; Number of Terminations: 2; Series: RMCF; Length: 0.061inch; Width: 0.031inch; Height: 0.022inch; Radiation Hardening: No; Lead Free: Lead Free; RoHS Compliant: Yes; ComponentLink1URL: https://www.seielect.com/Catalog/SEI-RMCF_RMCP.pdf?src-supplier=Digi-Key; ComponentLink1Description: https://www.seielect.com/Catalog/SEI-RMCF_RMCP.pdf?src-supplier=Digi-Key; ComponentLink2URL: https://www.seielect.com/catalog/SEI-Packaging.pdf?src-supplier=Digi-Key; ComponentLink2Description: https://www.seielect.com/catalog/SEI-Packaging.pdf?src-supplier=Digi-Key; ComponentLink3URL: https://www.seielect.com/catalog/SEI-RMCF_RMCP.pdf?src-supplier=Avnet; ComponentLink3Description: https://www.seielect.com/catalog/SEI-RMCF_RMCP.pdf?src-supplier=Avnet
R7 R8 R12 = RMCF0805FT10K0: RES 10K OHM 1% 1/8W 0805; Manufacturer: Stackpole Electronics; Resistance: 10kR; Power Rating: 125mW; Temperature Coefficient: 100ppm/°C; Supplier 1: Digi-Key; Manufacturer Part Number: RMCF0805FT10K0; RoHS: Yes; Category: Chip SMD Resistors; Stock 1: 2466676; Pricing 1: 1=0.10000, 10=0.02600, 100=0.01040, 1000=0.00466, 2500=0.00405 (USD); Mount: Surface Mount; Case/Package: 0805; Case Code (Metric): 2012; Case Code (Imperial): 0805; Contact Plating: Tin,Matte; Size Code: 0805; Min Operating Temperature: -55°C; Max Operating Temperature: 155°C; Tolerance: 1%; Packaging: Tape and Reel; Resistor Type: Thick Film; Number of Terminations: 2; Max Power Dissipation: 125mW; Features: Automotive AEC-Q200; Series: RMCF; Construction: Rectangular; Length: 2mm; Width: 0.049inch; Height: 0.026inch; Depth: 1.25mm; Radiation Hardening: No; Lead Free: Lead Free; Military Standard: Not; RoHS Compliant: Yes; ComponentLink1URL: https://datasheet.ciiva.com/15193/getdatasheetpartid-362046-15193525.pdf?src-supplier=Verical; ComponentLink1Description: https://datasheet.ciiva.com/15193/getdatasheetpartid-362046-15193525.pdf?src-supplier=Verical
R9 R11 = RC0603FR-07100KL: RES SMD 100K OHM 1% 1/10W 0603; Manufacturer: Yageo; Resistance: 100 kOhms; Power Rating: 100 mW; Voltage Rating: 50 V; Temperature Coefficient: 100 PPM / C; Supplier 1: Digi-Key; Supplier Part Number 1: 311-100KHRCT-ND; Manufacturer Part Number: RC0603FR-07100KL; Stock 1: 13478446; Pricing 1: 1=0.1, 10=0.022, 100=0.009, 1000=0.0041, 2500=0.0035 (USD); Termination Style: SMD/SMT; Product: Thick Film Resistors General Purpose; Tolerance: 1 %; Case Code - in: 0603; Case Code - mm: 1608; Series: RC; Operating Temperature Range: - 55 C to + 155 C; Packaging: Reel; ComponentLink1URL: http://www.farnell.com/datasheets/2167052.pdf?src-supplier=Element14; ComponentLink1Description: http://www.farnell.com/datasheets/2167052.pdf?src-supplier=Element14; ComponentLink2URL: http://www.farnell.com/datasheets/1868787.pdf?src-supplier=Element14; ComponentLink2Description: http://www.farnell.com/datasheets/1868787.pdf?src-supplier=Element14; ComponentLink3URL: http://documents.rs-components.com/techlib://itc_doclist_GB.htm?stockno=5048940&src-supplier=RSComponents; ComponentLink3Description: http://documents.rs-components.com/techlib://itc_doclist_GB.htm?stockno=5048940&src-supplier=RSComponents; ComponentLink4URL: http://www.farnell.com/datasheets/443971.pdf?src-supplier=Element14; ComponentLink4Description: http://www.farnell.com/datasheets/443971.pdf?src-supplier=Element14
R10 = RMCF0603FT30K1: RES SMD 30.1K OHM 1% 1/10W 0603; Manufacturer: Stackpole Electronics; Resistance: 30.1kR; Power Rating: 100mW; Temperature Coefficient: 100ppm/°C; Supplier 1: Digi-Key; Manufacturer Part Number: RMCF0603FT30K1; RoHS: Yes; Category: Chip SMD Resistors; Stock 1: 307080; Pricing 1: 1=0.10000, 10=0.01600, 100=0.00650, 1000=0.00292, 2500=0.00253 (USD); Mount: Surface Mount; Case/Package: 0603; Case Code (Metric): 1608; Case Code (Imperial): 0603; Contact Plating: Tin,Matte; Min Operating Temperature: -55°C; Max Operating Temperature: 155°C; Tolerance: 1%; Packaging: Tape and Reel; Resistor Type: Thick Film; Number of Terminations: 2; Max Power Dissipation: 100mW; Features: Automotive AEC-Q200; Series: RMCF; Construction: Rectangular; Length: 1.55mm; Width: 0.031inch; Height: 0.022inch; Depth: 0.8mm; Radiation Hardening: No; Military Standard: Not; RoHS Compliant: Yes; ComponentLink1URL: http://components.arrow.com/part/dataview/44987904S7172006N1174?src-supplier=Arrow+Electronics; ComponentLink1Description: http://components.arrow.com/part/dataview/44987904S7172006N1174?src-supplier=Arrow+Electronics; ComponentLink2URL: https://www.seielect.com/catalog/SEI-Packaging.pdf?src-supplier=Digi-Key; ComponentLink2Description: https://www.seielect.com/catalog/SEI-Packaging.pdf?src-supplier=Digi-Key; ComponentLink3URL: https://www.seielect.com/catalog/SEI-RMCF_RMCP.pdf?src-supplier=Avnet; ComponentLink3Description: https://www.seielect.com/catalog/SEI-RMCF_RMCP.pdf?src-supplier=Avnet; ComponentLink4URL: https://www.seielect.com/catalog/SEI-RMCF_RMCP.pdf?src-supplier=Avnet+Asia; ComponentLink4Description: https://www.seielect.com/catalog/SEI-RMCF_RMCP.pdf?src-supplier=Avnet+Asia; ComponentLink5URL: https://www.seielect.com/Catalog/SEI-RMCF_RMCP.pdf?src-supplier=Digi-Key; ComponentLink5Description: https://www.seielect.com/Catalog/SEI-RMCF_RMCP.pdf?src-supplier=Digi-Key; ComponentLink6URL: https://www.verical.com/server-webapp/html/getDatasheet?partID=717621&src-supplier=Verical; ComponentLink6Description: https://www.verical.com/server-webapp/html/getDatasheet?partID=717621&src-supplier=Verical
R25 = 73L2R20J: Res Thick Film 0603 0.2 Ohm 5% 1/10W ±300ppm/C Molded SMD SMD Paper T/R
RT1 = NTCLE101E3C90173: THERM NTC 10KOHM 3435K RADIAL; Manufacturer: Vishay BCcomponents; Max Power Dissipation: 250mW; Tolerance: 1%; Supplier 1: Digi-Key; Manufacturer Part Number: NTCLE101E3C90173; RoHS: Yes; Category: Thermistors; Stock 1: 1784; Pricing 1: 1=1.78000, 5=1.71600, 10=1.39500, 25=1.20160, 50=1.04060, 100=0.94400, 500=0.79384, 1000=0.70802, 5000=0.64365 (USD); Mount: Through Hole; Case/Package: Radial; Min Operating Temperature: -40°C; Max Operating Temperature: 125°C; Packaging: Bulk; RoHS Compliant: Yes; ComponentLink1URL: http://www.vishay.com/docs/29152/ntcle101e3c9017x.pdf?src-supplier=Digi-Key; ComponentLink1Description: http://www.vishay.com/docs/29152/ntcle101e3c9017x.pdf?src-supplier=Digi-Key
U1 = BQ24650RVAR: High Efficiency Synchronous Switch-Mode Charger Controller – Solar Battery Charger 16-VQFN -40 to 85; Manufacturer: Texas Instruments; Output Voltage: 26V; Min Supply Voltage: 5V; Max Supply Voltage: 28V; Output Current: 10A; Operating Supply Current: 25mA; Switching Frequency: 600kHz; Number of Cells: 123456; Supplier 1: Digi-Key; Manufacturer Part Number: BQ24650RVAR; RoHS: Yes; Category: Battery Management; Stock 1: 7704; Pricing 1: 1=4.94000, 10=4.44000, 25=4.19760, 100=3.45140, 250=3.09688, 500=2.98496, 1000=2.48125 (USD); Case/Package: VQFN EP; Number of Pins: 16; Contact Plating: Gold; Min Operating Temperature: -40°C; Max Operating Temperature: 85°C; Package Quantity: 3000; Packaging: Tape and Reel; Min Input Voltage: 5V; Series: -; Radiation Hardening: No; Lead Free: Lead Free; RoHS Compliant: Yes; ComponentLink1URL: https://datasheet.ciiva.com/15115/getdatasheetpartid-517726-15115144.pdf?src-supplier=Verical; ComponentLink1Description: https://datasheet.ciiva.com/15115/getdatasheetpartid-517726-15115144.pdf?src-supplier=Verical; ComponentLink2URL: https://datasheet.ciiva.com/1934/bq24650-1934895.pdf?src-supplier=Digi-Key; ComponentLink2Description: https://datasheet.ciiva.com/1934/bq24650-1934895.pdf?src-supplier=Digi-Key; ComponentLink3URL: https://datasheet.ciiva.com/3214/bq24650-3214319.pdf?src-supplier=Avnet; ComponentLink3Description: https://datasheet.ciiva.com/3214/bq24650-3214319.pdf?src-supplier=Avnet